# Altium schematic sheet DCDC_12V_Servo.SchDoc
size 420 x 297 mm; SheetNumber: 2; SheetTotal: 5
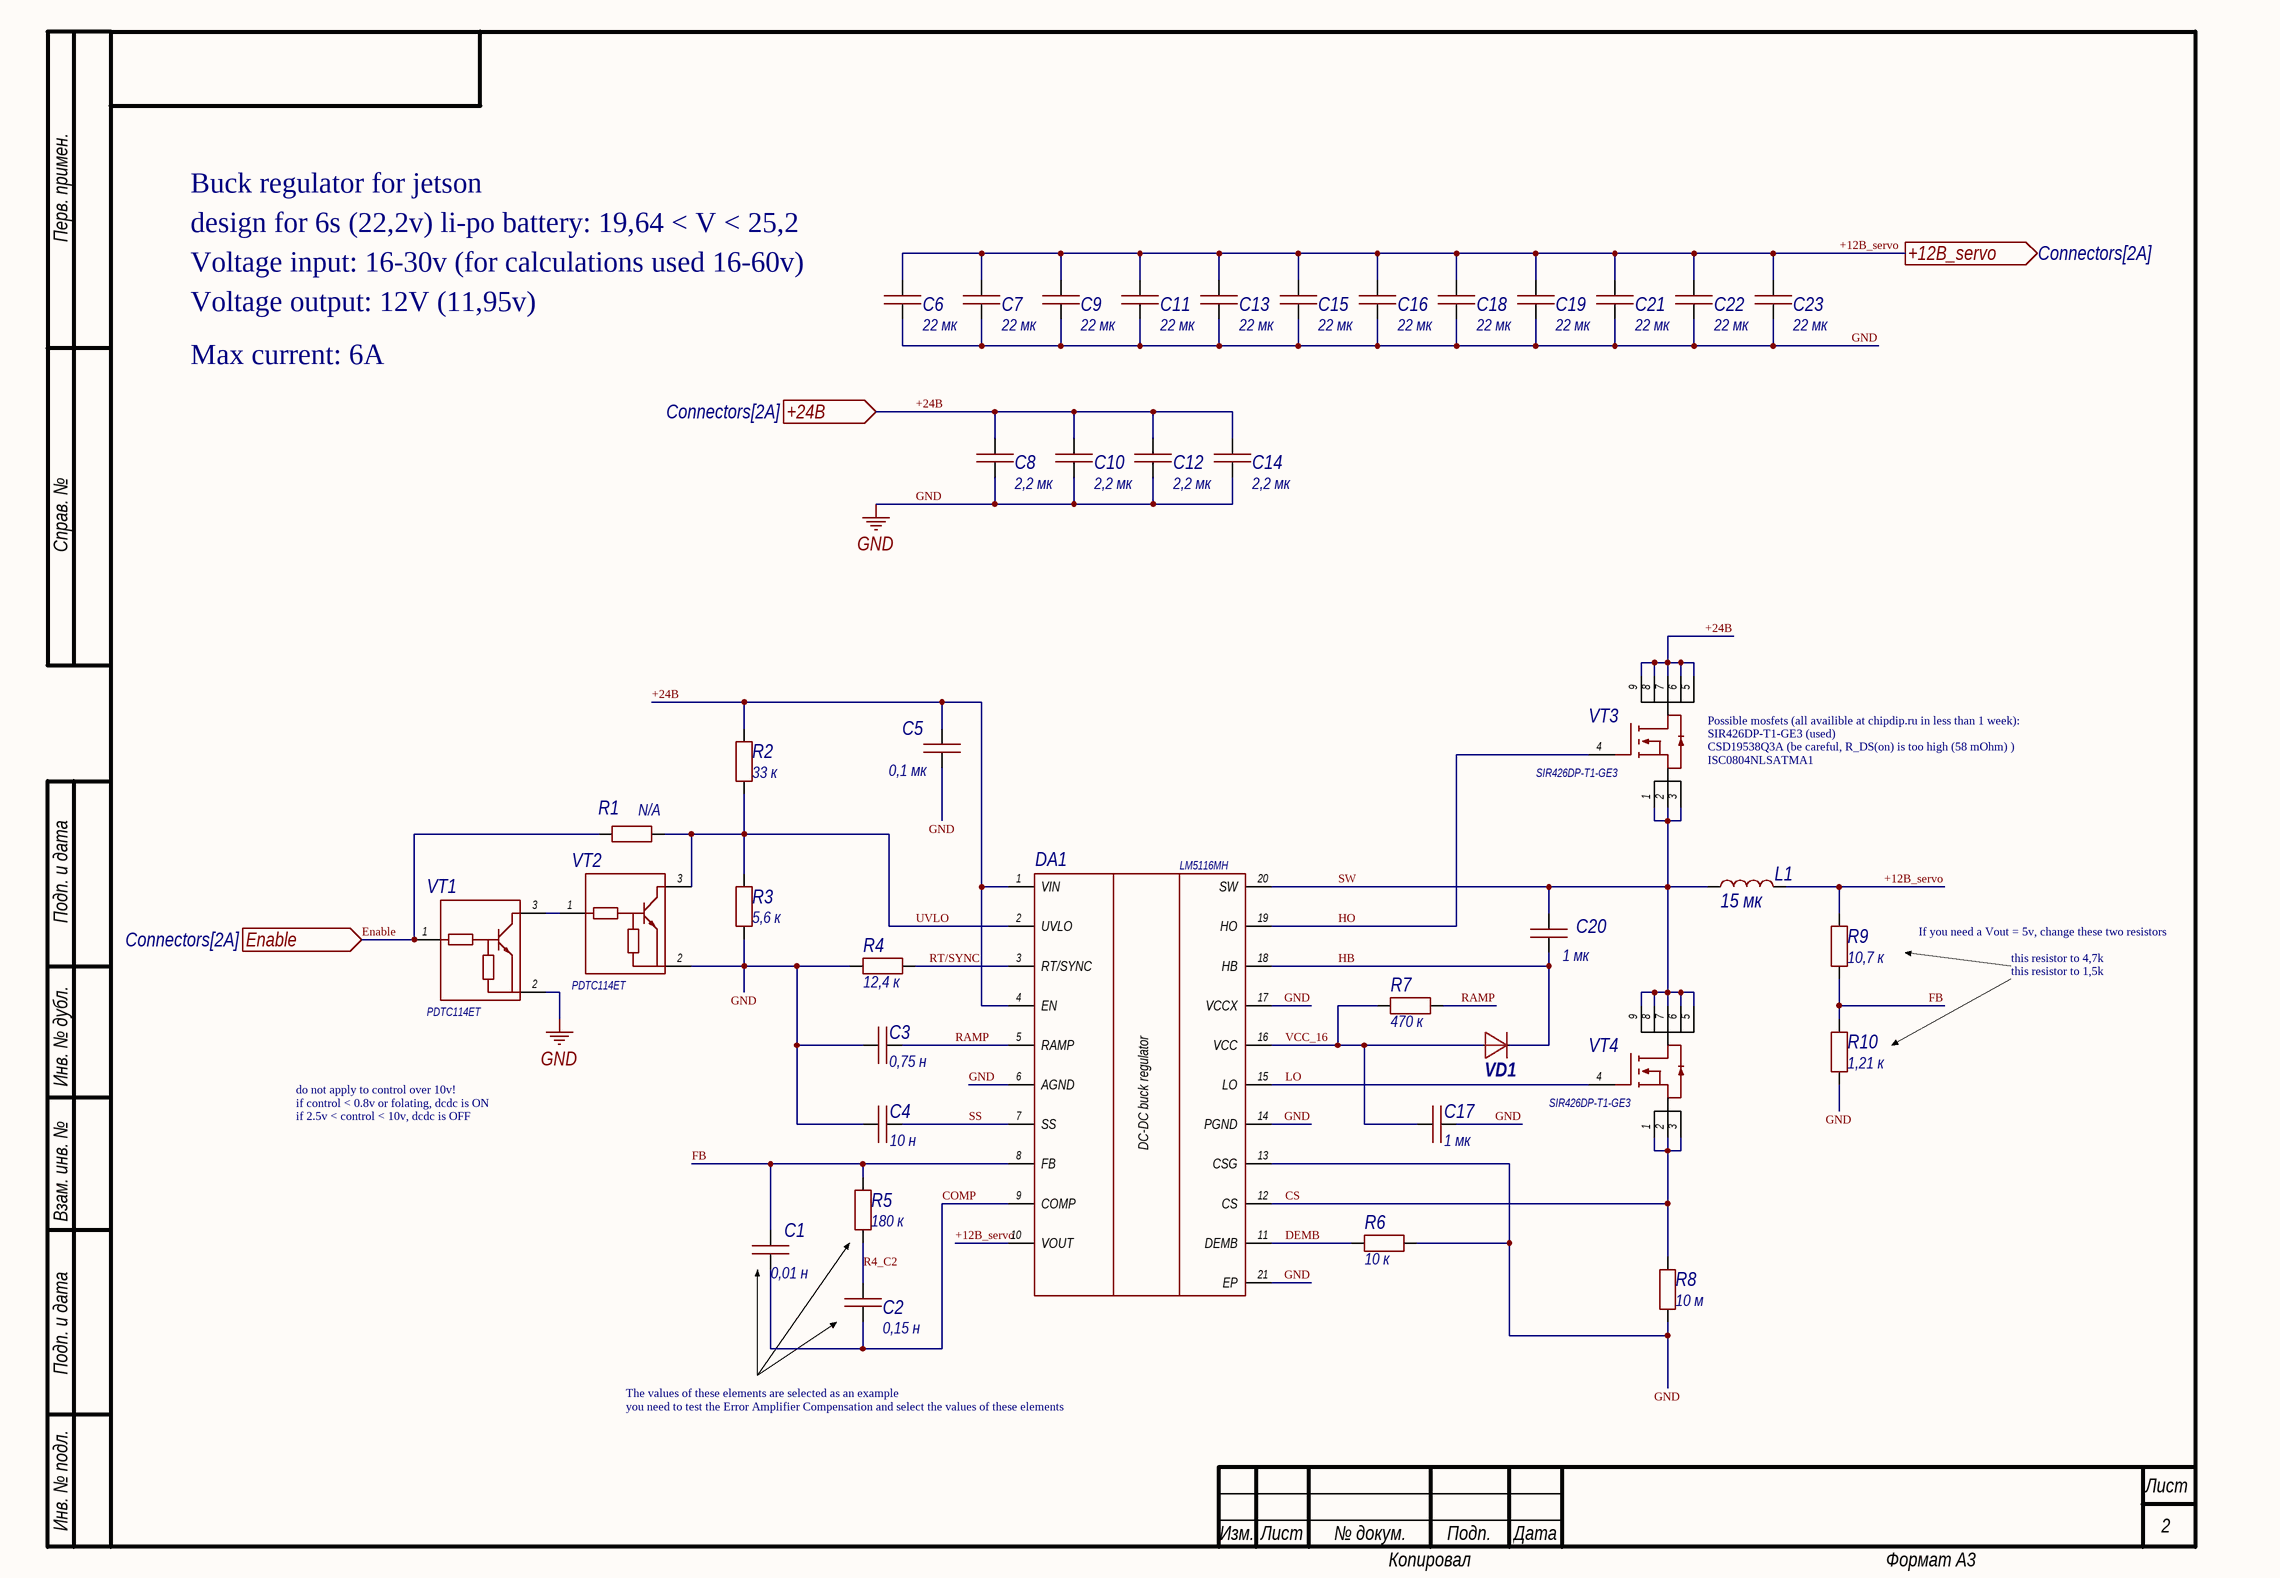
[diagram p0: DCDC_12V_Servo.SchDoc]

## Parts
C1  value 0,01 н  [0603C]  (hidden comment: Capacitor)
C2  value 0,15 н  [0603C]  (hidden comment: Capacitor)
C3  value 0,75 н  [0603C]  (hidden comment: Capacitor)
C4  value 10 н  [0603C]  (hidden comment: Capacitor)
C5  value 0,1 мк  [0603C]  (hidden comment: Capacitor)
C6  value 22 мк  [1210C]  (hidden comment: Capacitor)
C7  value 22 мк  [1210C]  (hidden comment: Capacitor)
C8  value 2,2 мк  [1206C]  (hidden comment: Capacitor)
C9  value 22 мк  [1210C]  (hidden comment: Capacitor)
C10  value 2,2 мк  [1206C]  (hidden comment: Capacitor)
C11  value 22 мк  [1210C]  (hidden comment: Capacitor)
C12  value 2,2 мк  [1206C]  (hidden comment: Capacitor)
C13  value 22 мк  [1210C]  (hidden comment: Capacitor)
C14  value 2,2 мк  [1206C]  (hidden comment: Capacitor)
C15  value 22 мк  [1210C]  (hidden comment: Capacitor)
C16  value 22 мк  [1210C]  (hidden comment: Capacitor)
C17  value 1 мк  [0603C]  (hidden comment: Capacitor)
C18  value 22 мк  [1210C]  (hidden comment: Capacitor)
C19  value 22 мк  [1210C]  (hidden comment: Capacitor)
C20  value 1 мк  [0603C]  (hidden comment: Capacitor)
C21  value 22 мк  [1210C]  (hidden comment: Capacitor)
C22  value 22 мк  [1210C]  (hidden comment: Capacitor)
C23  value 22 мк  [1210C]  (hidden comment: Capacitor)
DA1  LM5116MH  [HTSSOP-20]
L1  value 15 мк  [SPRH127]  (hidden comment: CDSPRH127-150M)
R1  Resistor  [0603R]  (value not drawn)
R2  value 33 к  [0603R]  (hidden comment: Resistor)
R3  value 5,6 к  [0603R]  (hidden comment: Resistor)
R4  value 12,4 к  [0603R]  (hidden comment: Resistor)
R5  value 180 к  [0603R]  (hidden comment: Resistor)
R6  value 10 к  [0603R]  (hidden comment: Resistor)
R7  value 470 к  [0603R]  (hidden comment: Resistor)
R8  value 10 м  [1210R]  (hidden comment: Resistor)
R9  value 10,7 к  [0603R]  (hidden comment: Resistor)
R10  value 1,21 к  [0603R]  (hidden comment: Resistor)
VD1  ES1D-E3/61T  [SMA]  (value not drawn)
VT1  PDTC114ET  [SOT23-3]
VT2  PDTC114ET  [SOT23-3]
VT3  SIR426DP-T1-GE3  [PowerPAK_SO-8]
VT4  SIR426DP-T1-GE3  [PowerPAK_SO-8]

## Ports
+12В_servo (out, see Connectors[2A]), +24В (in, see Connectors[2A]), Enable (in, see Connectors[2A])

## Nets
GND: C3.1 C4.1 C5.1 C6.1 C7.1 C8.1 C9.1 C10.1 C11.1 C12.1 C13.1 C14.1 C15.1 C16.1 C17.2 C18.1 C19.1 C21.1 C22.1 C23.1 DA1.6(AGND) DA1.13(CSG) DA1.14(PGND) DA1.17(VCCX) DA1.21(EP) R3.1 R4.1 R6.2 R8.1 R10.1 VT1.2(E) VT2.2(E)
+12В_servo: C6.2 C7.2 C9.2 C11.2 C13.2 C15.2 C16.2 C18.2 C19.2 C21.2 C22.2 C23.2 DA1.10(VOUT) L1.2 R9.2 ; port +12В_servo
+24В: C5.2 C8.2 C10.2 C12.2 C14.2 DA1.1(VIN) DA1.4(EN) R2.2 VT3.5 VT3.6 VT3.7 VT3.8 VT3.9 ; port +24В
COMP: C1.1 C2.1 DA1.9(COMP)
CS: DA1.12(CS) R8.2 VT4.1 VT4.2 VT4.3
DEMB: DA1.11(DEMB) R6.1
Enable: R1.1 VT1.1(B) ; port Enable
FB: C1.2 DA1.8(FB) R5.2 R9.1 R10.2
HB: C20.1 DA1.18(HB) VD1.2
HO: DA1.19(HO) VT3.4
LO: DA1.15(LO) VT4.4
R4_C2: C2.2 R5.1
RAMP: C3.2 DA1.5(RAMP) R7.2
RT/SYNC: DA1.3(RT/SYNC) R4.2
SS: C4.2 DA1.7(SS)
SW: C20.2 DA1.20(SW) L1.1 VT3.1 VT3.2 VT3.3 VT4.5 VT4.6 VT4.7 VT4.8 VT4.9
UVLO: DA1.2(UVLO) R1.2 R2.1 R3.2 VT2.3(C)
VCC_16: C17.1 DA1.16(VCC) R7.1 VD1.1
NetVT1_3: VT1.3(C) VT2.1(B)

## Notes on the sheet
- design for 6s (22,2v) li-po battery: 19,64 < V < 25,2
- Buck regulator for jetson
- (near C6) Voltage input: 16-30v (for calculations used 16-60v)
- Voltage output: 12V (11,95v)
- Max current: 6A
- (near VT3) Possible mosfets (all availible at chipdip.ru in less than 1 week):
- (near VT3) CSD19538Q3A (be careful, R_DS(on) is too high (58 mOhm) )
- (near VT3) SIR426DP-T1-GE3 (used)
- (near VT3) ISC0804NLSATMA1
- If you need a Vout = 5v, change these two resistors
- this resistor to 4,7k
- this resistor to 1,5k
- if 2.5v < control < 10v, dcdc is OFF
- if control < 0.8v or folating, dcdc is ON
- do not apply to control over 10v!
- The values of these elements are selected as an example
- you need to test the Error Amplifier Compensation and select the values of these elements
- Перв. примен.
- Справ. №
- Подп. и дата
- Инв. № дубл.
- Взам. инв. №
- Инв. № подл.
- Изм.
- Лист
- № докум.
- Подп.
- Дата
- Копировал
- Формат А3
- (in symbol LM5116MH) DC-DC buck regulator

## Library data of the parts
C1 = Capacitor_0,01n_10_50V_X7R_0603C: Конденсатор; Library Path2: Schematic\Capacitor.SchLib; Tolerance: 0,1; Voltage (V): 50; Dielectric: X7R; Capacity (nF): 0,01; Part Number: Capacitor_0,01n_10_50V_X7R_0603C
C2 = Capacitor_0,15n_10_50V_X7R_0603C: Конденсатор; Library Path2: Schematic\Capacitor.SchLib; Tolerance: 0,1; Voltage (V): 50; Dielectric: X7R; Capacity (nF): 0,15; Part Number: Capacitor_0,15n_10_50V_X7R_0603C
C3 = Capacitor_0,75n_10_50V_X7R_0603C: Конденсатор; Library Path2: Schematic\Capacitor.SchLib; Tolerance: 0,1; Voltage (V): 50; Dielectric: X7R; Capacity (nF): 0,75; Part Number: Capacitor_0,75n_10_50V_X7R_0603C
C4 = Capacitor_10n_10_50V_X7R_0603C: Конденсатор; Library Path2: Schematic\Capacitor.SchLib; Tolerance: 0,1; Voltage (V): 50; Dielectric: X7R; Capacity (nF): 10; Part Number: Capacitor_10n_10_50V_X7R_0603C
C5 = Capacitor_0,1u_10_50V_X7R_0603C: Конденсатор; Library Path2: Schematic\Capacitor.SchLib; Tolerance: 0,1; Voltage (V): 50; Dielectric: X7R; Capacity (nF): 100; Part Number: Capacitor_0,1u_10_50V_X7R_0603C
C6 C7 C9 C11 C13 C15 C16 C18 C19 C21-C23 = Capacitor_22u_10_25V_X7R_1210C: Конденсатор; Library Path2: Schematic\Capacitor.SchLib; Tolerance: 0,1; Voltage (V): 25; Dielectric: X7R; Capacity (nF): 22000; Part Number: Capacitor_22u_10_25V_X7R_1210C
C8 C10 C12 C14 = Capacitor_2,2u_10_50V_X7R_1206C: Конденсатор; Library Path2: Schematic\Capacitor.SchLib; Tolerance: 0,1; Voltage (V): 50; Dielectric: X7R; Capacity (nF): 2200; Part Number: Capacitor_2,2u_10_50V_X7R_1206C
C17 C20 = Capacitor_1u_10_50V_X7R_0603C: Конденсатор; Library Path2: Schematic\Capacitor.SchLib; Tolerance: 0,1; Voltage (V): 50; Dielectric: X7R; Capacity (nF): 1000; Part Number: Capacitor_1u_10_50V_X7R_0603C
DA1 = LM5116MH: dc-dc понижающий adj 6-100v; Manufacturer_Part_Number: LM5116MH/NOPB; Part Number: LM5116MH
L1 = CDSPRH127-150M: Индуктивность на 15 мкГн, номинальный ток 8,4 А; Inductance (μH): 15; Current (A): 8,4; Part Number: CDSPRH127-150M
R1 = res_0603_N/A: посадочное место 0603 под перемычку; Tolerance: 1%; Power: *; Value: N/A; Part Number: res_0603_N/A
R2 = Resistor_33k_1_0603: Резистор номиналом 33 кОм и точностью 1%; Power: *; Part Number: Resistor_33k_1_0603; Tolerance: 1%
R3 = Resistor_5.6k_1_0603: Резистор номиналом 5,6 кОм 1%; Power: *; Part Number: Resistor_5.6k_1_0603; Tolerance: 1%
R4 = Resistor_12.4k_1_0603: Резистор номиналом 12,4 кОм и точностью 1%; Power: *; Part Number: Resistor_12.4k_1_0603; Tolerance: 1%
R5 = Resistor_180k_1_0603: Резистор номиналом 180 кОм и точностью 1%; Power: *; Part Number: Resistor_180k_1_0603; Tolerance: 1%
R6 = Resistor_10k_1_0603: Резистор номиналом 10 кОм и точностью 1%; Power: *; Part Number: Resistor_10k_1_0603; Tolerance: 1%
R7 = Resistor_470k_1_0603: Резистор номиналом 470 кОм и точностью 1%; Power: *; Part Number: Resistor_470k_1_0603; Tolerance: 1%
R8 = RL1210FR-070R01L: Резистор номиналом 10 мОм, точностью 1%, 0.5Вт; Power: *; Part Number: RL1210FR-070R01L; Tolerance: 1%
R9 = Resistor_10.7k_1_0603: Резистор номиналом 10,7 кОм и точностью 1%; Power: *; Part Number: Resistor_10.7k_1_0603; Tolerance: 1%
R10 = Resistor_1.21k_1_0603: Резистор номиналом 1,21 кОм и точностью 1%; Power: *; Part Number: Resistor_1.21k_1_0603; Tolerance: 1%
VD1 = ES1D-E3/61T: Диод 1A 200V; Repetitive peak reverse voltage (Vrrm): 200; Current (A): 1; Part Number: ES1D-E3/61T
VT1 VT2 = PDTC114ET: цифровой npn 50в 100мА; Ток макс#: 0, 1 А; Part Number: PDTC114ET; Напряжение С-И/К-Э: 50 В
VT3 VT4 = SIR426DP-T1-GE3: Транзистор полевой MOSFET N-канальный 40В 41.7Вт; Part Number: SIR426DP-T1-GE3; Напряжение С-И/К-Э: 40 В